# EAGLE design straingaugerev0 (EAGLE 6.2)
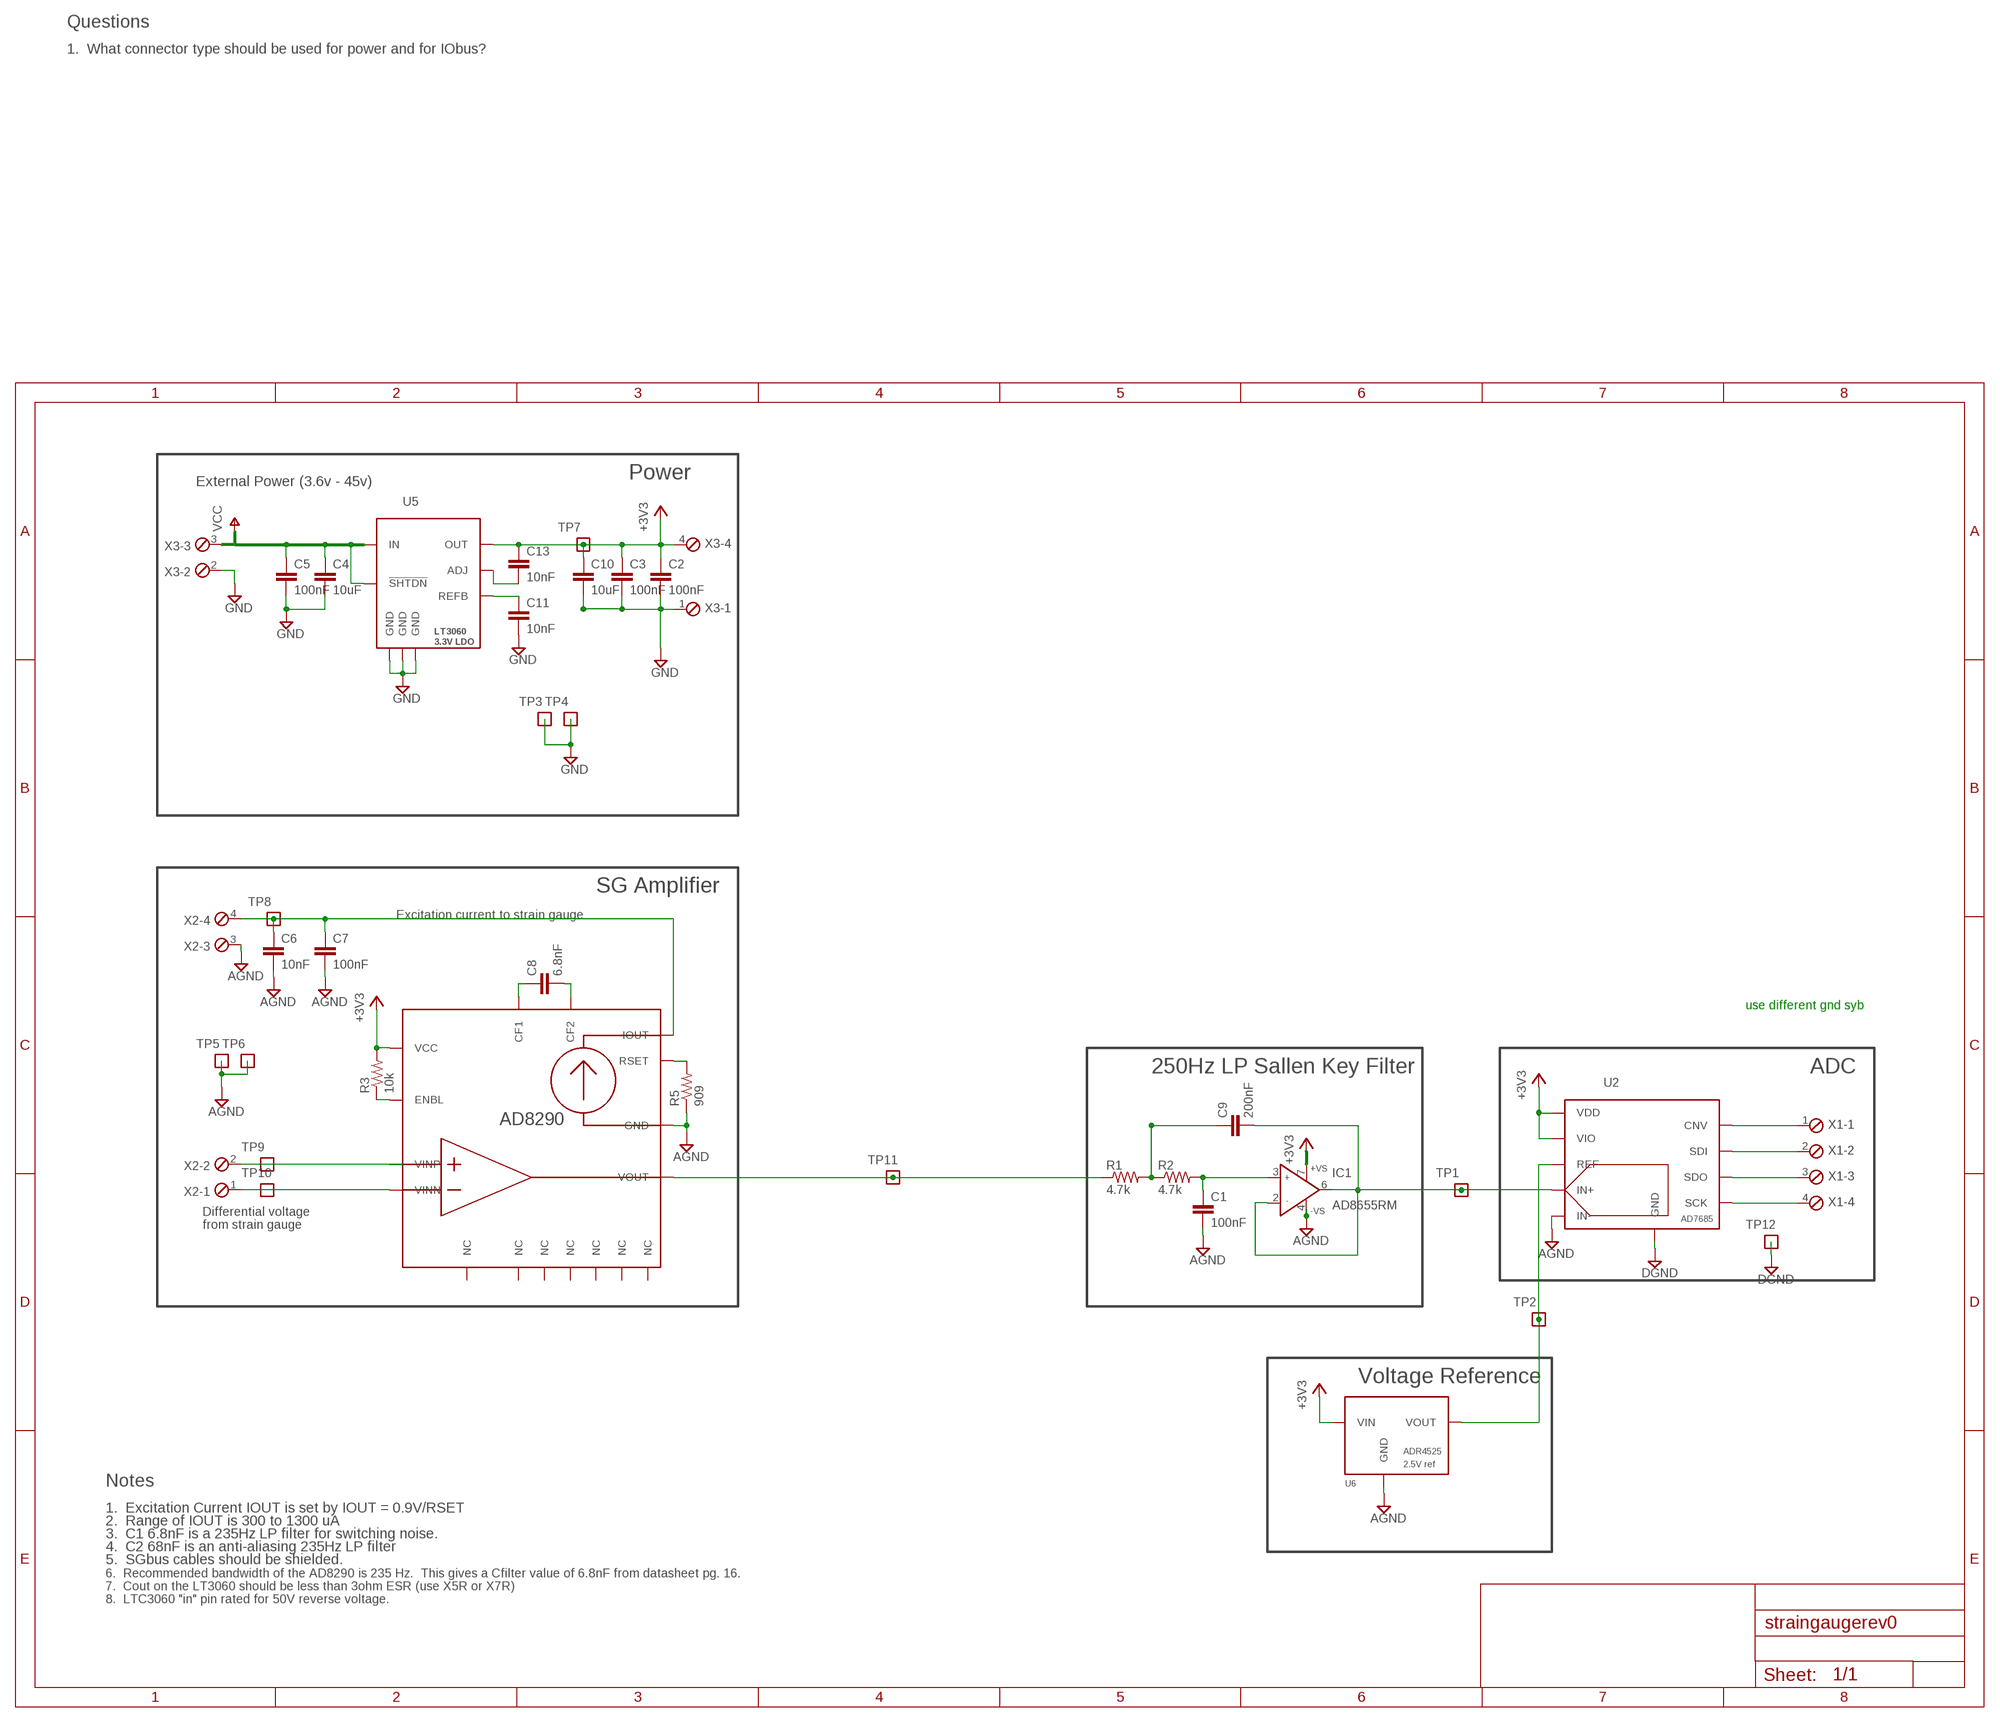
[diagram p0: schematic, sheet 1]

## Parts
C1  100nF  C-EUC0402  [C0402]
C2  100nF  C-EUC0402  [C0402]
C3  100nF  C-EUC0402  [C0402]
C4  10uF  C-EUC0805  [C0805]
C5  100nF  C-EUC0402  [C0402]
C6  10nF  C-EUC0402  [C0402]
C7  100nF  C-EUC0603  [C0603]
C8  6.8nF  C-EUC0402  [C0402]
C9  200nF  C-EUC0402  [C0402]
C10  10uF  C-EUC0805  [C0805]
C11  10nF  C-EUC0402  [C0402]
C13  10nF  C-EUC0402  [C0402]
IC1  AD8655RM  [MSOP08]
R1  4.7k  R-US_R0402  [R0402]
R2  4.7k  R-US_R0402  [R0402]
R3  10k  R-US_R0402  [R0402]
R5  909  R-US_R0603  [R0603]
TP1  TEST-POINT  [2MM-TEST-POINT]
TP2  TEST-POINT  [2MM-TEST-POINT]
TP3  TEST-POINT  [2MM-TEST-POINT]
TP4  TEST-POINT  [2MM-TEST-POINT]
TP5  TEST-POINT  [2MM-TEST-POINT]
TP6  TEST-POINT  [2MM-TEST-POINT]
TP7  TEST-POINT  [2MM-TEST-POINT]
TP8  TEST-POINT  [2MM-TEST-POINT]
TP9  TEST-POINT  [2MM-TEST-POINT]
TP10  TEST-POINT  [2MM-TEST-POINT]
TP11  TEST-POINT  [2MM-TEST-POINT]
TP12  TEST-POINT  [2MM-TEST-POINT]
U1  AD8290  [LFCSP_UQ-16]
U2  AD7685  [MSOP-10]
U5  LT3060  [TSOT-23-8]
U6  ADR4525  [SOIC-8]
X1  MPT4  [4POL254]
X2  MPT4  [4POL254]
X3  MPT4  [4POL254]

## Nets
3V3: IC1.7(+VS) U2.2(VDD) U2.10(VIO) U6.2(VIN) ; supply symbol labelled +3V3
+3V3: C2.1 C3.1 C10.1 C13.1 R3.2 TP7.1 U1.2(VCC) U5.7(OUT) X3.4
ADJ: C13.2 U5.6(ADJ)
AGND: C1.2 C6.2 C7.2 IC1.4(-VS) R5.1 TP5.1 TP6.1 U1.10(GND) U2.4(IN-) U6.4(GND) X2.3
CF1: C8.1 U1.6(CF1)
CF2: C8.2 U1.5(CF2)
CNV: U2.6(CNV) X1.1
DGND: TP12.1 U2.5(GND)
ENBL: R3.1 U1.3(ENBL)
GND: C2.2 C3.2 C4.2 C5.2 C10.2 TP3.1 TP4.1 U5.2(GND) U5.3(GND) U5.4(GND) X3.1 X3.2
IEXT: C6.1 C7.1 TP8.1 U1.13(IOUT) X2.4
IN+: C9.2 IC1.2(IN-) IC1.6(OUT) TP1.1 U2.3(IN+)
NA: C11.2 ; supply symbol labelled GND
REF: TP2.1 U2.1(REF) U6.6(VOUT)
REFB: C11.1 U5.5(REFB)
RSET: R5.2 U1.11(RSET)
SCK: U2.8(SCK) X1.4
SDI: U2.9(SDI) X1.2
SDO: U2.7(SDO) X1.3
V1: C9.1 R1.2 R2.1
V+: C1.1 IC1.3(IN+) R2.2
VCC: C4.1 C5.1 U5.1(!SHTDN) U5.8(IN) X3.3
VINN: TP10.1 U1.14(VINN) X2.1
VINP: TP9.1 U1.15(VINP) X2.2
VOUT: R1.1 TP11.1 U1.4(VOUT)
Unconnected: U1.1(NC) U1.7(NC) U1.8(NC) U1.9(NC) U1.12(NC) U1.16(NC) U1.FLOAT(NC)

## Notes on the sheet
- Questions
- 1.  What connector type should be used for power and for IObus?
- Power
- External Power (3.6v - 45v)
- SG Amplifier
- Excitation current to strain gauge
- use different gnd syb
- 250Hz LP Sallen Key Filter | ADC
- Differential voltage
- from strain gauge
- Voltage Reference
- Notes
- 1.  Excitation Current IOUT is set by IOUT = 0.9V/RSET
- 2.  Range of IOUT is 300 to 1300 uA
- 3.  C1 6.8nF is a 235Hz LP filter for switching noise.
- 4.  C2 68nF is an anti-aliasing 235Hz LP filter
- 5.  SGbus cables should be shielded.
- 6.  Recommended bandwidth of the AD8290 is 235 Hz.  This gives a Cfilter value of 6.8nF from datasheet pg. 16.
- 7.  Cout on the LT3060 should be less than 3ohm ESR (use X5R or X7R)
- 8.  LTC3060 "in" pin rated for 50V reverse voltage.

## Library data of the parts
C1-C11 C13 = rcl:C-EU: CAPACITOR, European symbol
IC1 = analog-devices:AD8655: Low Noise, Precision CMOS Amplifier Source: http://www.analog.com/static/imported-files/data_sheets/AD8655_8656.pdf; MF: ALTERA CORPORATION; MPN: AD8655ARZ; OC_FARNELL: 1078267; OC_NEWARK: 59K7052
R1-R3 R5 = rcl:R-US_: RESISTOR, American symbol
TP1-TP12 = straingauge:TEST-POINT
U1 = AD8290:AD8290
U2 = straingauge:AD7685
U5 = straingauge:LT3060
U6 = straingauge:ADR4525
X1-X3 = straingauge:MPT4: PHOENIX CONNECTOR; OC_FARNELL: unknown; OC_NEWARK: unknown

## Board
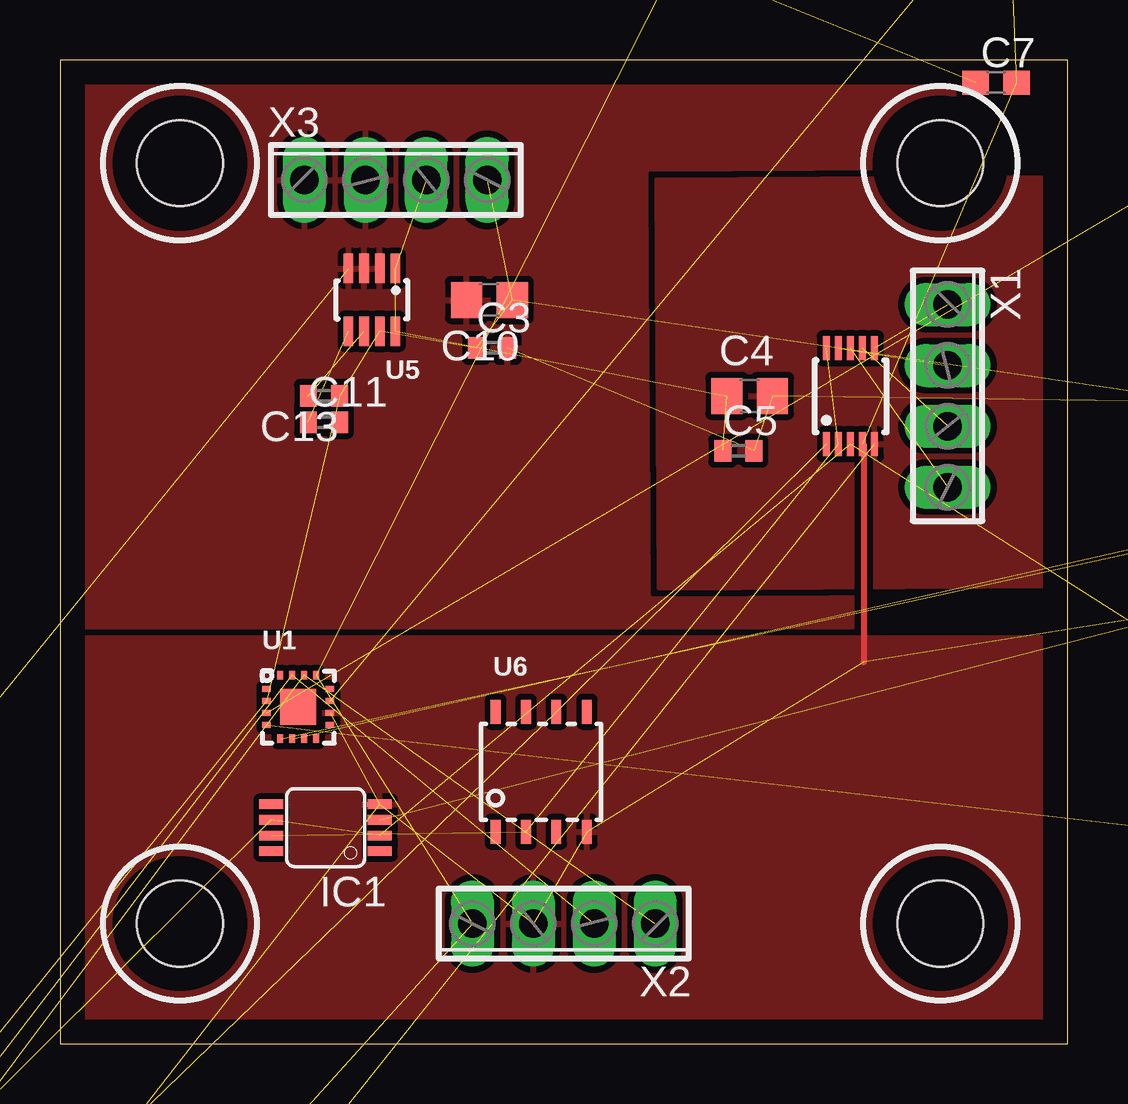
[diagram p1: board, top side]
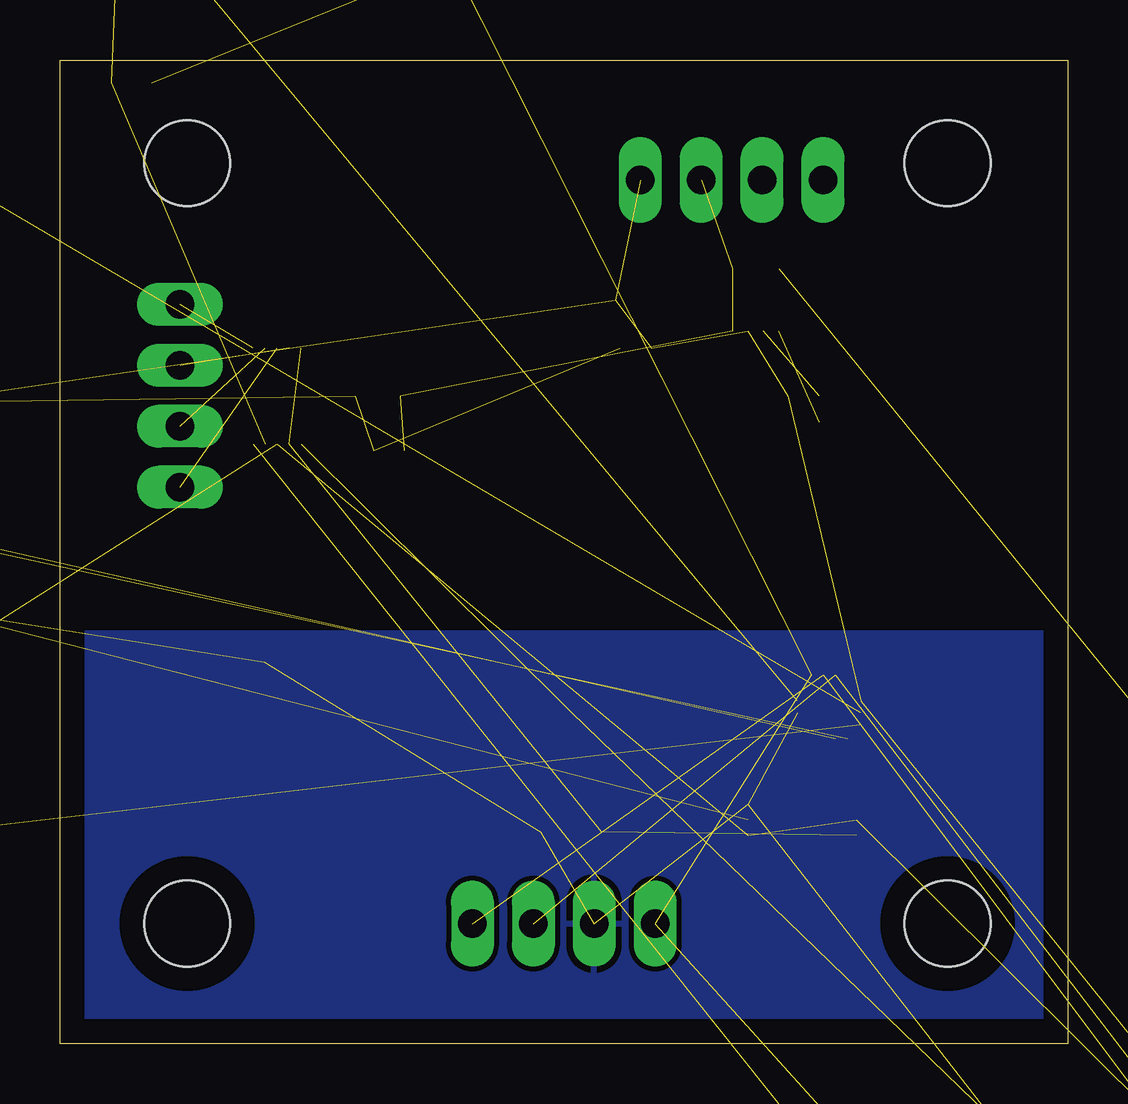
[diagram p2: board, bottom side, seen from below]

Size 42 x 41 mm. Coordinates in mm from the lower left corner, seen from the top.
Outline: 0,0 42,0 42,41 0,41 0,0
Copper layers (1*16): Top 0.035mm / dielectric 1.5mm / Bottom 0.035mm
Design rules: minimum track width 10mil, minimum drill 24mil, track to track 8mil, track to pad 8mil, pad to pad 8mil, via to via 8mil, smd to smd 8mil, copper to edge 40mil, drill to drill 8mil, minimum pad ring 10mil, minimum via ring 8mil, stop-mask expansion 4mil, vias tented up to drill 0mil, thermal gap 10mil
Holes 3.58 mm at 5,5 36.7,5 36.7,36.7 5,36.7

### Footprints (pad centres in the part's own frame; a part is rotated, then mirrored left to right if it is on the bottom)
C0402 = smd 0.7 x 0.9: 1 -0.65,0; 2 0.65,0
C0805 = smd 1.3 x 1.5: 1 -0.95,0; 2 0.95,0
C0603 = smd 1.1 x 1: 1 -0.85,0; 2 0.85,0
MSOP08 = smd 0.4 x 1: 1 -0.976,-2.263; 2 -0.326,-2.263; 3 0.324,-2.263; 4 0.974,-2.263; 5 0.974,2.262; 6 0.324,2.262; 7 -0.326,2.262; 8 -0.976,2.262
R0402 = smd 0.7 x 0.9: 1 -0.65,0; 2 0.65,0
R0603 = smd 1 x 1.1: 1 -0.85,0; 2 0.85,0
2MM-TEST-POINT = drill 0.737: 1 0,0
LFCSP_UQ-16 = smd 0.35 x 0.25: 1 -1.325,0.75; 2 -1.325,0.25; 3 -1.325,-0.25; 4 -1.325,-0.75; 9 1.325,-0.75; 10 1.325,-0.25; 11 1.325,0.25; 12 1.325,0.75 | smd 0.25 x 0.35: 5 -0.75,-1.325; 6 -0.25,-1.325; 7 0.25,-1.325; 8 0.75,-1.325; 13 0.75,1.325; 14 0.25,1.325; 15 -0.25,1.325; 16 -0.75,1.325 | smd 1.5 x 1.5: FLOAT 0,0
MSOP-10 = smd 0.3 x 1: 1 -1,-2; 2 -0.5,-2; 3 0,-2; 4 0.5,-2; 5 1,-2; 6 1,2; 7 0.5,2; 8 0,2; 9 -0.5,2; 10 -1,2
TSOT-23-8 = smd 0.4 x 1.22: 1 -0.975,-1.31; 2 -0.325,-1.31; 3 0.325,-1.31; 4 0.975,-1.31; 5 0.975,1.31; 6 0.325,1.31; 7 -0.325,1.31; 8 -0.975,1.31
SOIC-8 = smd 0.4 x 1: 1 -1.905,-2.5; 2 -0.635,-2.5; 3 0.635,-2.5; 4 1.905,-2.5; 5 1.905,2.5; 6 0.635,2.5; 7 -0.635,2.5; 8 -1.905,2.5
4POL254 = drill 1.2 long: 1 -3.81,0; 2 -1.27,0; 3 1.27,0; 4 3.81,0

### Placement (x,y rotation side)
C1  50.26,18.68 0 top  (outside the outline)
C2  48.52,26.72 0 top  (outside the outline)
C3  18,29 0 top
C4  28.75,26.99 0 top
C5  28.28,24.71 0 top
C6  26.32,45.13 0 top  (outside the outline)
C7  39.02,40.05 0 top
C8  59.15,23.76 0 top  (outside the outline)
C9  50.26,13.6 0 top  (outside the outline)
C10  17.9,31 180 top
C11  11,25.9 0 top
C13  11,27 180 top
IC1  11.07,9 90 top
R1  50.26,8.52 0 top  (outside the outline)
R2  50.26,3.44 0 top  (outside the outline)
R3  48.52,36.88 0 top  (outside the outline)
R5  40.29,50.21 0 top  (outside the outline)
TP1  -104.14,-102.87 0 top  (outside the outline)
TP2  -104.14,-106.68 0 top  (outside the outline)
TP3  -104.14,-110.49 0 top  (outside the outline)
TP4  -104.14,-114.3 0 top  (outside the outline)
TP5  -104.1,-140.9 0 top  (outside the outline)
TP6  -104.1,-144.6 0 top  (outside the outline)
TP7  -104.14,-125.73 0 top  (outside the outline)
TP8  -104.14,-129.54 0 top  (outside the outline)
TP9  -104.14,-133.35 0 top  (outside the outline)
TP10  -104.14,-137.16 0 top  (outside the outline)
TP11  49.79,30.53 0 top  (outside the outline)
TP12  -104.1,-148.3 0 top  (outside the outline)
U1  9.93,14.03 0 top
U2  32.95,26.98 0 top
U5  13,31 180 top
U6  20.06,11.33 0 top
X1  37,27 270 top
X2  21,5 180 top
X3  14,36 0 top

### Tracks (layer width: path | path; a pad name or v marks a point on that pad's centre or on a via)
3V3  (3 unrouted)
+3V3  (8 unrouted)
ADJ  (1 unrouted)
AGND  (10 unrouted)
  Top 0.254: U2.4 33.5,24.98 33.5,15.9
  pour Top (isolate 0.254, rank 4): 0,16.9 42.1,16.9 42,0 34.9,0 -0.1,-0.1
  pour Bottom: 0,17.1 42,17.1 42,0 0,0
CF1  (1 unrouted)
CF2  (1 unrouted)
CNV  (1 unrouted)
DGND  (1 unrouted)
  pour Top (isolate 0.254, rank 4): 25,19 24.9,36 41.9,36.1 42,19.1
ENBL  (1 unrouted)
GND  (5 unrouted)
  pour Top (isolate 0.254, rank 5): 0,41 42,41 42,0 0,0
IEXT  (4 unrouted)
IN+  (4 unrouted)
REF  (2 unrouted)
REFB  (1 unrouted)
RSET  (1 unrouted)
SCK  (1 unrouted)
SDI  (1 unrouted)
SDO  (1 unrouted)
V1  (2 unrouted)
V+  (2 unrouted)
VCC  (4 unrouted)
VINN  (2 unrouted)
VINP  (2 unrouted)
VOUT  (2 unrouted)